# Altium schematic sheet USB_IFC.SchDoc
size A3; DocumentNumber: 12; SheetNumber: 12; SheetTotal: 12
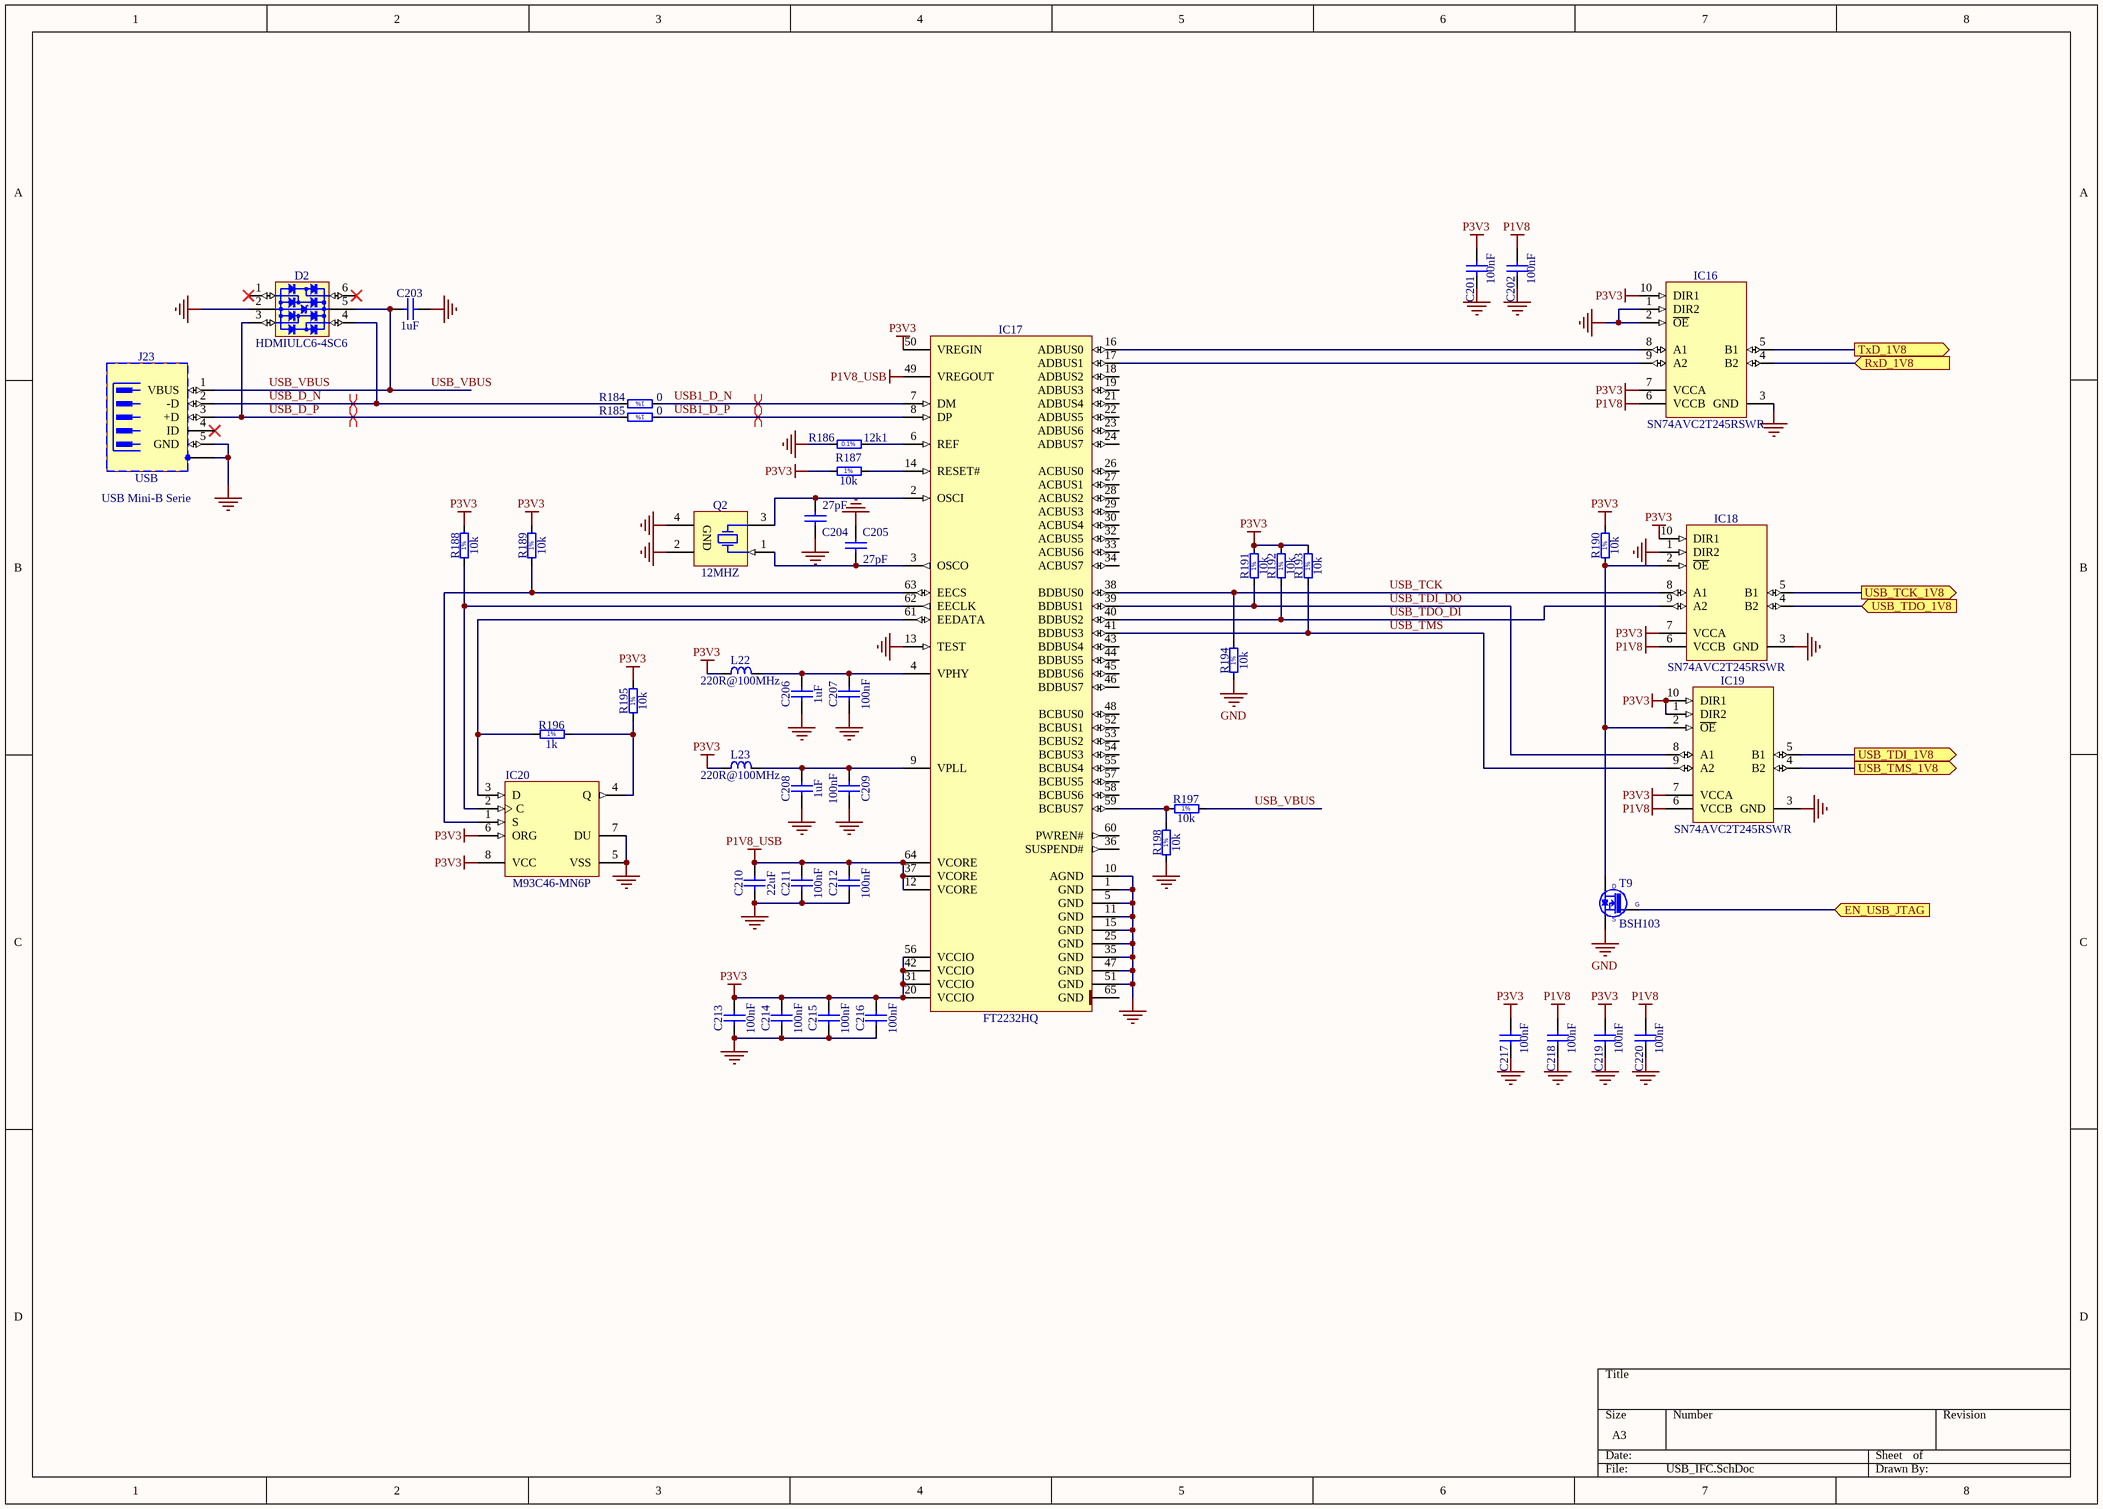
[diagram p0: USB_IFC.SchDoc]

## Parts
C201  100nF  [CAPC0603X33N]
C202  100nF  [CAPC0603X33N]
C203  1uF  [CAPC1005X55N]
C204  27pF  [CAPC1608X87N]
C205  27pF  [CAPC1608X87N]
C206  1uF  [CAPC1005X55N]
C207  100nF  [CAPC0603X33N]
C208  1uF  [CAPC1005X55N]
C209  100nF  [CAPC0603X33N]
C210  22uF  [CAPC2012X135N]
C211  100nF  [CAPC0603X33N]
C212  100nF  [CAPC0603X33N]
C213  100nF  [CAPC0603X33N]
C214  100nF  [CAPC0603X33N]
C215  100nF  [CAPC0603X33N]
C216  100nF  [CAPC0603X33N]
C217  100nF  [CAPC0603X33N]
C218  100nF  [CAPC0603X33N]
C219  100nF  [CAPC0603X33N]
C220  100nF  [CAPC0603X33N]
D2  HDMIULC6-4SC6  [SOT95P280X145-6N]
IC16  SN74AVC2T245RSWR  [QFN40P140X180X55-10N]
IC17  FT2232HQ  [QFN50P900X900X100-65N-S445]
IC18  SN74AVC2T245RSWR  [QFN40P140X180X55-10N]
IC19  SN74AVC2T245RSWR  [QFN40P140X180X55-10N]
IC20  M93C46-MN6P  [SOIC127P600X175-8N]
J23  USB  [WURTH_651005136521]
L22  220R@100MHz  [INDC2012X105N]
L23  220R@100MHz  [INDC2012X105N]
Q2  12MHZ  [XTAL_ABRACON_ABM3B]
R184  0  [RESC1608X55N]
R185  0  [RESC1608X55N]
R186  12k1  [RESC1608X55N]
R187  10k  [RESC1005X40N]
R188  10k  [RESC1005X40N]
R189  10k  [RESC1005X40N]
R190  10k  [RESC1005X40N]
R191  10k  [RESC1005X40N]
R192  10k  [RESC1005X40N]
R193  10k  [RESC1005X40N]
R194  10k  [RESC1005X40N]
R195  10k  [RESC1005X40N]
R196  1k  [RESC1005X40N]
R197  10k  [RESC1005X40N]
R198  10k  [RESC1005X40N]
T9  BSH103  [SOT95P230X110-3N]

## Ports
EN_USB_JTAG (in), RxD_1V8 (in), TxD_1V8 (out), USB_TCK_1V8 (out), USB_TDI_1V8 (out), USB_TDO_1V8 (in), USB_TMS_1V8 (out)

## Nets
GND: C201.1 C202.1 C203.2 C204.2 C205.1 C206.1 C207.1 C208.1 C209.2 C210.1 C211.1 C212.1 C213.1 C214.1 C215.1 C216.1 C217.1 C218.1 C219.1 C220.1 D2.2(GND) IC16.1(DIR2) IC16.2(~{OE}) IC16.3(GND) IC17.1(GND) IC17.5(GND) IC17.10(AGND) IC17.11(GND) IC17.13(TEST) IC17.15(GND) IC17.25(GND) IC17.35(GND) IC17.47(GND) IC17.51(GND) IC18.1(DIR2) IC18.3(GND) IC19.3(GND) IC20.5(VSS) IC20.7(DU) J23.5(GND) J23.6(SH) Q2.2(GND) Q2.4(GND) R186.1 R194.1 R198.1 T9.2(S)
P1V8: C202.2 C218.2 C220.2 IC16.6(VCCB) IC18.6(VCCB) IC19.6(VCCB)
P1V8_USB: C210.2 C211.2 C212.2 IC17.12(VCORE) IC17.37(VCORE) IC17.49(VREGOUT) IC17.64(VCORE)
P3V3: C201.2 C213.2 C214.2 C215.2 C216.2 C217.2 C219.2 IC16.7(VCCA) IC16.10(DIR1) IC17.20(VCCIO) IC17.31(VCCIO) IC17.42(VCCIO) IC17.50(VREGIN) IC17.56(VCCIO) IC18.7(VCCA) IC18.10(DIR1) IC19.1(DIR2) IC19.7(VCCA) IC19.10(DIR1) IC20.6(ORG) IC20.8(VCC) L22.1 L23.1 R187.1 R188.2 R189.2 R190.2 R191.2 R192.2 R193.2 R195.2
EN_USB_JTAG: T9.1(G) ; port EN_USB_JTAG
RxD_1V8: IC16.4(B2) ; port RxD_1V8
TxD_1V8: IC16.5(B1) ; port TxD_1V8
USB1_D_N: IC17.7(DM) R184.1
USB1_D_P: IC17.8(DP) R185.1
USB_D_N: D2.4(I/O3) J23.2(-D) R184.2
USB_D_P: D2.3(I/O2) J23.3(+D) R185.2
USB_TCK: IC17.38(BDBUS0) IC18.8(A1) R194.2
USB_TCK_1V8: IC18.5(B1) ; port USB_TCK_1V8
USB_TDI_1V8: IC19.5(B1) ; port USB_TDI_1V8
USB_TDI_DO: IC17.39(BDBUS1) IC19.8(A1) R191.1
USB_TDO_1V8: IC18.4(B2) ; port USB_TDO_1V8
USB_TDO_DI: IC17.40(BDBUS2) IC18.9(A2) R192.1
USB_TMS: IC17.41(BDBUS3) IC19.9(A2) R193.1
USB_TMS_1V8: IC19.4(B2) ; port USB_TMS_1V8
USB_VBUS: C203.1 D2.5(VBUS) J23.1(VBUS) R197.2
NetC204_1: C204.1 IC17.2(OSCI) Q2.3(X)
NetC205_2: C205.2 IC17.3(OSCO) Q2.1(X)
NetC206_2: C206.2 C207.2 IC17.4(VPHY) L22.2
NetC208_2: C208.2 C209.1 IC17.9(VPLL) L23.2
NetIC16_8: IC16.8(A1) IC17.16(ADBUS0)
NetIC16_9: IC16.9(A2) IC17.17(ADBUS1)
NetIC17_6: IC17.6(REF) R186.2
NetIC17_14: IC17.14(RESET#) R187.2
NetIC17_59: IC17.59(BCBUS7) R197.1 R198.2
NetIC17_61: IC17.61(EEDATA) IC20.3(D) R196.1
NetIC17_62: IC17.62(EECLK) IC20.2(C) R188.1
NetIC17_63: IC17.63(EECS) IC20.1(S) R189.1
NetIC18_2: IC18.2(~{OE}) IC19.2(~{OE}) R190.1 T9.3(D)
NetIC20_4: IC20.4(Q) R195.1 R196.2

Not connected (* = marked no-connect by the designer): D2 1(I/O1)* 6(I/O4)*; IC17 18(ADBUS2) 19(ADBUS3) 21(ADBUS4) 22(ADBUS5) 23(ADBUS6) 24(ADBUS7) 26(ACBUS0) 27(ACBUS1) 28(ACBUS2) 29(ACBUS3) 30(ACBUS4) 32(ACBUS5) 33(ACBUS6) 34(ACBUS7) 36(SUSPEND#) 43(BDBUS4) 44(BDBUS5) 45(BDBUS6) 46(BDBUS7) 48(BCBUS0) 52(BCBUS1) 53(BCBUS2) 54(BCBUS3) 55(BCBUS4) 57(BCBUS5) 58(BCBUS6) 60(PWREN#) 65(GND); J23 4(ID)*

## Layout directives
differential pair: USB1_D_N, USB1_D_P, USB_D_N, USB_D_P

## Notes on the sheet
- (near J23) USB Mini-B Serie
- (in symbol R0402_1K_1%_0.0625W_100PPM) 1%
- (in symbol R0402_10K_1%_0.0625W_100PPM) 1%
- (in symbol R0603_0R_JUMPER) 1%
- (in symbol R0603_12K1_0.1%_0.063W_10PPM) 0.1%

## Library data of the parts
C201 C202 C207 C209 C211-C220 = CC0201_100NF_6.3V_10%_X5R: Non-polarised capacitor; Part Description: SMD Multilayer Chip Ceramic Capacitor; Manufacturer: GENERIC; Manufacturer1 Part Number: 02016D104KAT2A; Voltage: 6.3V; TC: X5R; Tolerance: ±10%; Part Number: CC0201_100NF_6.3V_10%_X5R; Component Kind: Standard; Component Type: Standard; Pin Count: 2; Value: 100nF; Status: Not Recommended; Manufacturer Part Number: CC0201_100NF_6.3V_10%_X5R; Case: 0201; Mounted: Yes; Socket: No; SMD: Yes; Sense: No; Manufacturer1 Example: AVX; Manufacturer1 ComponentHeight: 0.33mm; HelpURL: \\cern.ch\dfs\Applications\Altium\Datasheets\CC0201_X5R_AVX.pdf; Author: CERN DEM JLC
  C201 C202 C217-C220: CreateDate: 2007-12-03; LatestRevisionDate: 2007-12-03
  C207 C209 C211-C216: CreateDate: 03.12.2007; LatestRevisionDate: 03.12.2007
C203 C206 C208 = CC0402_1UF_16V_10%_X5R: Non-polarised capacitor; Part Description: SMD Multilayer Chip Ceramic Capacitor; Manufacturer: GENERIC; Manufacturer1 Part Number: C1005X5R1C105KT; Voltage: 16V; TC: X5R; Tolerance: ±10%; Part Number: CC0402_1UF_16V_10%_X5R; Component Kind: Standard; Component Type: Standard; Pin Count: 2; Value: 1uF; Status: Preferred; Manufacturer Part Number: CC0402_1UF_16V_10%_X5R; Case: 0402; Mounted: Yes; Socket: No; SMD: Yes; Manufacturer1 Example: TDK; Manufacturer1 ComponentHeight: 0.55mm; HelpURL: \\cern.ch\dfs\Applications\Altium\Datasheets\CC0402_X5R_TDK_C.pdf; Author: CERN DEM JLC; CreateDate: 25.10.2012; LatestRevisionDate: 25.10.2012; Sense: No
C204 C205 = CC0603_27PF_50V_5%_NP0: Non-polarised capacitor; Part Description: SMD Multilayer Chip Ceramic Capacitor; Manufacturer: GENERIC; Manufacturer1 Part Number: 223886715279; Voltage: 50V; TC: NP0; Tolerance: ±5%; Table: Capacitors SMD; Part Number: CC0603_27PF_50V_5%_NP0; Component Kind: Standard; Component Type: Standard; Pin Count: 2; Value: 27pF; Status: Preferred; Manufacturer Part Number: CC0603_27PF_50V_5%_NP0; Case: 0603; Mounted: Yes; Socket: Yes; SMD: Yes; Manufacturer1 Example: PHYCOMP; Manufacturer1 ComponentHeight: 0.87mm; HelpURL: \\cern.ch\dfs\Applications\Altium\Datasheets\CC0603_NP0_PHYCOMP.pdf; Author: CERN DEM JLC; CreateDate: 2007-12-03; LatestRevisionDate: 2007-12-03
C210 = CC0805_22UF_6.3V_20%_X5R: Non-polarised capacitor; Part Description: SMD Multilayer Chip Ceramic Capacitor; Manufacturer: GENERIC; Manufacturer1 Part Number: C0805C226M9PAC7800; Voltage: 6.3V; TC: X5R; Tolerance: ±20%; Part Number: CC0805_22UF_6.3V_20%_X5R; Component Kind: Standard; Component Type: Standard; Pin Count: 2; Value: 22uF; Status: Preferred; Manufacturer Part Number: CC0805_22UF_6.3V_20%_X5R; Case: 0805; Mounted: Yes; Socket: No; SMD: Yes; Manufacturer1 Example: KEMET; Manufacturer1 ComponentHeight: 1.45mm; HelpURL: \\cern.ch\dfs\Applications\Altium\Datasheets\CC1206_X5R_KEMET.pdf; Author: CERN DEM JLC; CreateDate: 03.12.2007; LatestRevisionDate: 03.12.2007; Sense: No
D2 = HDMIULC6-4SC6: Ultra Large Bandwidth HDMI ESD Protection; Part Description: Ultra Large Bandwidth HDMI ESD (15kV) Protection; Manufacturer: ST MICROELECTRONICS; Voltage: 6V; Table: Diodes; Part Number: HDMIULC6-4SC6; Component Kind: Standard; Component Type: Standard; Device: HDMIULC6-4SC6; PackageDescription: SOT23, 6-Leads, Body 1.6x3.0mm, Pitch 0.95mm, IPC Medium Density; Manufacturer Part Number: HDMIULC6-4SC6; Pin Count: 6; Case: SOT23-6; Mounted: Yes; Socket: Yes; SMD: Yes; ComponentHeight: 1.45mm; HelpURL: \\cern.ch\dfs\Applications\Altium\Datasheets\HDMIULC6-4SC6.pdf; Author: CERN DEM JLC; CreateDate: 04/06/2012; LatestRevisionDate: 04/06/2012
IC16 IC18 IC19 = SN74AVC2T245RSWR: Dual-Bit Dual-Supply Bus Transceiver With Configurable Voltage Translation and 3-State Outputs; Manufacturer: TEXAS INSTRUMENTS; PressFit: No; Bonding: No; Part Number: SN74AVC2T245RSWR; Component Kind: Standard; Component Type: Standard; Device: SN74AVC2T245RSWR; PackageDescription: QFN, 0.40mm Pitch, Rect.;10 Pin, 1.80mm L X 1.40mm W X 0.55mm H Body, IPC Medium Density; Status: Not Recommended; Part Description: Dual-Bit Dual-Supply Bus Transceiver With Configurable Voltage Translation and 3-State Outputs; Manufacturer Part Number: SN74AVC2T245RSWR; Pin Count: 10; Case: QFN10; Mounted: Yes; Socket: No; SMD: Yes; Sense: No; ComponentHeight: 0.55mm; Author: CERN DEM JLC; HelpURL: \\cern.ch\dfs\Applications\Altium\Datasheets\SN74AVC2T245RSWR.pdf; CreateDate: 07.07.2014; LatestRevisionDate: 30.03.2017
IC17 = FT2232HQ: Dual High Speed USB To Multipurpose UART/FIFO IC, 64-pin QFN, Tray; Manufacturer: FUTURE TECHNOLOGY DEVICES INTERNATIONAL (FTDI); PressFit: No; Bonding: No; Part Number: FT2232HQ; Component Kind: Standard; Component Type: Standard; Device: FT2232HQ; PackageDescription: QFN, 0.50mm Pitch, Square;64 Pin,9.00mm L X 9.00mm W X 1.00mm H Body (4.45 X 4.45mm Thermal Tab), IPC Medium Density; Part Description: Dual High Speed USB To Multipurpose UART/FIFO IC; Manufacturer Part Number: FT2232HQ; Pin Count: 64; Case: QFN64; Mounted: Yes; Socket: No; SMD: Yes; Sense: No; ComponentHeight: 1mm; Author: CERN DEM JLC; HelpURL: \\cern.ch\dfs\Applications\Altium\Datasheets\FT2232HQ.pdf; CreateDate: 12.11.2014; LatestRevisionDate: 12.11.2014
IC20 = M93C46-MN6P: 1Kb (x8/x16) Serial Microwire Bus EEPROM; Part Description: 1K (128 x 8 or 64 x 16 bit) Serial Microwire Bus EEPROM; Manufacturer: ST MICROELECTRONICS; Table: Logic; Bonding: Yes; Part Number: M93C46-MN6P; Component Kind: Standard; Component Type: Standard; Device: M93C46-MN6P; PackageDescription: SOIC 8, Pitch 1.27mm - Body 4x5mm, IPC Medium Density; Manufacturer Part Number: M93C46-MN6P; Pin Count: 8; Case: SOIC8; Mounted: Yes; Socket: Yes; SMD: Yes; ComponentHeight: 1.75mm; HelpURL: \\cern.ch\dfs\Applications\Altium\Datasheets\M93C46-MN6P.pdf; Author: CERN DEM JLC; CreateDate: 09/09/2008; LatestRevisionDate: 15/11/2012; Status: Obsolete; PressFit: Yes
J23 = WURTH_651005136521: 5 Pin + 1 Shield USB Receptacle; Part Description: Mini USB Type B  Receptacle, Horizontal, 5 Contacts; Manufacturer: WURTH ELEKTRONIK; PressFit: No; Part Number: WURTH_651005136521; Component Kind: Standard; Component Type: Standard; Pin Count: 6; Family: USB; Mounted: Yes; Socket: No; SMD: No; Sense: No; Status: None; Manufacturer Part Number: 651005136521; ComponentHeight: 3.9mm; HelpURL: \\cern.ch\dfs\Applications\Altium\Datasheets\WURTH_651005136521.pdf; Author: CERN DEM JLC; CreateDate: 07.03.2011; LatestRevisionDate: 07.03.2011
L22 L23 = IND0805_MURATA_BLM21PG221SN1D: Inductor; Part Description: SMD EMIFIL Suppression Chip Ferrite Bead; Manufacturer: MURATA; Power: 2A; Resistance: 0.05R; Tolerance: ±25%; Table: Inductors SMD; Part Number: IND0805_MURATA_BLM21PG221SN1D; Component Kind: Standard; Component Type: Standard; Pin Count: 2; Value: 220R@100MHz; Status: None; Manufacturer Part Number: BLM21PG221SN1D; Case: 0805; Mounted: Yes; Socket: Yes; SMD: Yes; ComponentHeight: 1.05mm; HelpURL: \\cern.ch\dfs\Applications\Altium\Datasheets\IND0402_MURATA_BLM21P.pdf; Author: CERN DEM JLC; CreateDate: 25/01/2010; LatestRevisionDate: 25/01/2010
Q2 = XTAL_12MHZ_ABRACON_ABM3B-12.000MHZ-B2-T: Crystal 4 pins 1=XTAL Control 2=GND3=XTAL 4=GND; Part Description: Tolerance:± 20ppm, Stability:± 50ppm, -20°C to +70°C, 18pF, Ceramic SMD Crystal, ABM3B Series; Table: Crystals & Oscillators; Bonding: Yes; Part Number: XTAL_12MHZ_ABRACON_ABM3B-12.000MHZ-B2-T; Component Kind: Standard; Component Type: Standard; PackageDescription: ABM3B Serie, SMD Cristal, Body 5.x3.2mm; Value: 12MHZ; Manufacturer: ABRACON; Manufacturer Part Number: ABM3B-12.000MHZ-B2-T; Pin Count: 2; Mounted: Yes; Socket: Yes; SMD: Yes; ComponentHeight: 1.1mm; HelpURL: \\cern.ch\dfs\Applications\Altium\Datasheets\XTAL_ABRACON_ABM3B.pdf; Author: CERN DEM JLC; CreateDate: 06/03/2012; LatestRevisionDate: 06/03/2012; PressFit: Yes
R184 R185 = R0603_0R_JUMPER: Resistor - 1%; Part Description: 1A (0.05R Max DC Resistance) Zero Ohm Jumper; Manufacturer: GENERIC; Manufacturer1 Part Number: NRC06Z0; Table: Resistors SMD; Part Number: R0603_0R_JUMPER; Component Kind: Standard; Component Type: Standard; Pin Count: 2; Value: 0; Status: Preferred; Manufacturer Part Number: R0603_0R_JUMPER; Case: 0603; Mounted: Yes; Socket: Yes; SMD: Yes; Manufacturer1 Example: NIC COMPONENT; Manufacturer1 ComponentHeight: 0.55mm; HelpURL: \\cern.ch\dfs\Applications\Altium\Datasheets\R0603_NIC_NRC.pdf; Author: CERN DEM JLC; CreateDate: 12/3/2007; LatestRevisionDate: 3/13/2008
R186 = R0603_12K1_0.1%_0.063W_10PPM: Resistor - 0.1%; Part Description: Thin Film Chip Resistor; Manufacturer: GENERIC; Manufacturer1 Part Number: RN73C1J12K1BTDF; Power: 0.063W; TC: ±10ppm; Table: Resistors SMD; Part Number: R0603_12K1_0.1%_0.063W_10PPM; Component Kind: Standard; Component Type: Standard; Pin Count: 2; Value: 12k1; Status: Not recommended; Tolerance: ±0.1%; Manufacturer Part Number: R0603_12K1_0.1%_0.063W_10PPM; Case: 0603; Mounted: Yes; Socket: Yes; SMD: Yes; Manufacturer1 Example: TYCO HOLSWORTHY; Manufacturer1 ComponentHeight: 0.5mm; HelpURL: \\cern.ch\dfs\Applications\Altium\Datasheets\R0603_Tyco_RN73.pdf; Author: CERN DEM JLC; CreateDate: 2007-12-03; LatestRevisionDate: 2008-03-13
R187-R195 R197 R198 = R0402_10K_1%_0.0625W_100PPM: Resistor - 1%; Part Description: General Purpose Thick Film Chip Resistor; Manufacturer: GENERIC; Manufacturer1 Part Number: 232270671003L; TC: ±100ppm/°C; PressFit: No; Part Number: R0402_10K_1%_0.0625W_100PPM; Component Kind: Standard; Component Type: Standard; Pin Count: 2; Value: 10k; Status: Not Recommended; Power: 0.0625W; Tolerance: ±1%; Manufacturer Part Number: R0402_10K_1%_0.0625W_100PPM; Case: 0402; Mounted: Yes; Socket: No; SMD: Yes; Manufacturer1 Example: YAGEO PHYCOMP; Manufacturer1 ComponentHeight: 0.4mm; HelpURL: \\cern.ch\dfs\Applications\Altium\Datasheets\R0402_Phycomp_RC0402.pdf; Author: CERN DEM JLC; CreateDate: 03.12.2007; LatestRevisionDate: 17.10.2012; Sense: No
R196 = R0402_1K_1%_0.0625W_100PPM: Resistor - 1%; Part Description: General Purpose Thick Film Chip Resistor; Manufacturer: GENERIC; Manufacturer1 Part Number: 232270671002L; TC: ±100ppm/°C; PressFit: No; Part Number: R0402_1K_1%_0.0625W_100PPM; Component Kind: Standard; Component Type: Standard; Pin Count: 2; Value: 1k; Status: Not Recommended; Power: 0.0625W; Tolerance: ±1%; Manufacturer Part Number: R0402_1K_1%_0.0625W_100PPM; Case: 0402; Mounted: Yes; Socket: No; SMD: Yes; Manufacturer1 Example: YAGEO PHYCOMP; Manufacturer1 ComponentHeight: 0.4mm; HelpURL: \\cern.ch\dfs\Applications\Altium\Datasheets\R0402_Phycomp_RC0402.pdf; Author: CERN DEM JLC; CreateDate: 03.12.2007; LatestRevisionDate: 17.10.2012; Sense: No
T9 = BSH103: N-CHANNEL MOSFET WITH DIODE; Part Description: 30V 850mA N-Channel Enhancement Mode Field-Effect Transistor; Manufacturer: NEXPERIA; PressFit: No; Bonding: No; Part Number: BSH103; Component Kind: Standard; Component Type: Standard; Device: BSH103; PackageDescription: SOT23, 3 pin, Pitch 0.95mm - 1.3mm W X 2.9mm L X 1.1mm H, IPC Medium Density; Manufacturer Part Number: BSH103; Pin Count: 3; Case: SOT23-3; Mounted: Yes; Socket: No; SMD: Yes; Sense: No; ComponentHeight: 1.1mm; HelpURL: \\cern.ch\dfs\Applications\Altium\Datasheets\BSH103.pdf; Author: CERN DEM JLC; CreateDate: 16.03.2010; LatestRevisionDate: 20.06.2017